# EasyEDA schematic OpenTCU.json

## Sheets
1 SPI CAN: TITLE: SPI CAN; REV: 1.0; Date: 2024-01-22; Sheet: 1/1; Company: Your Company
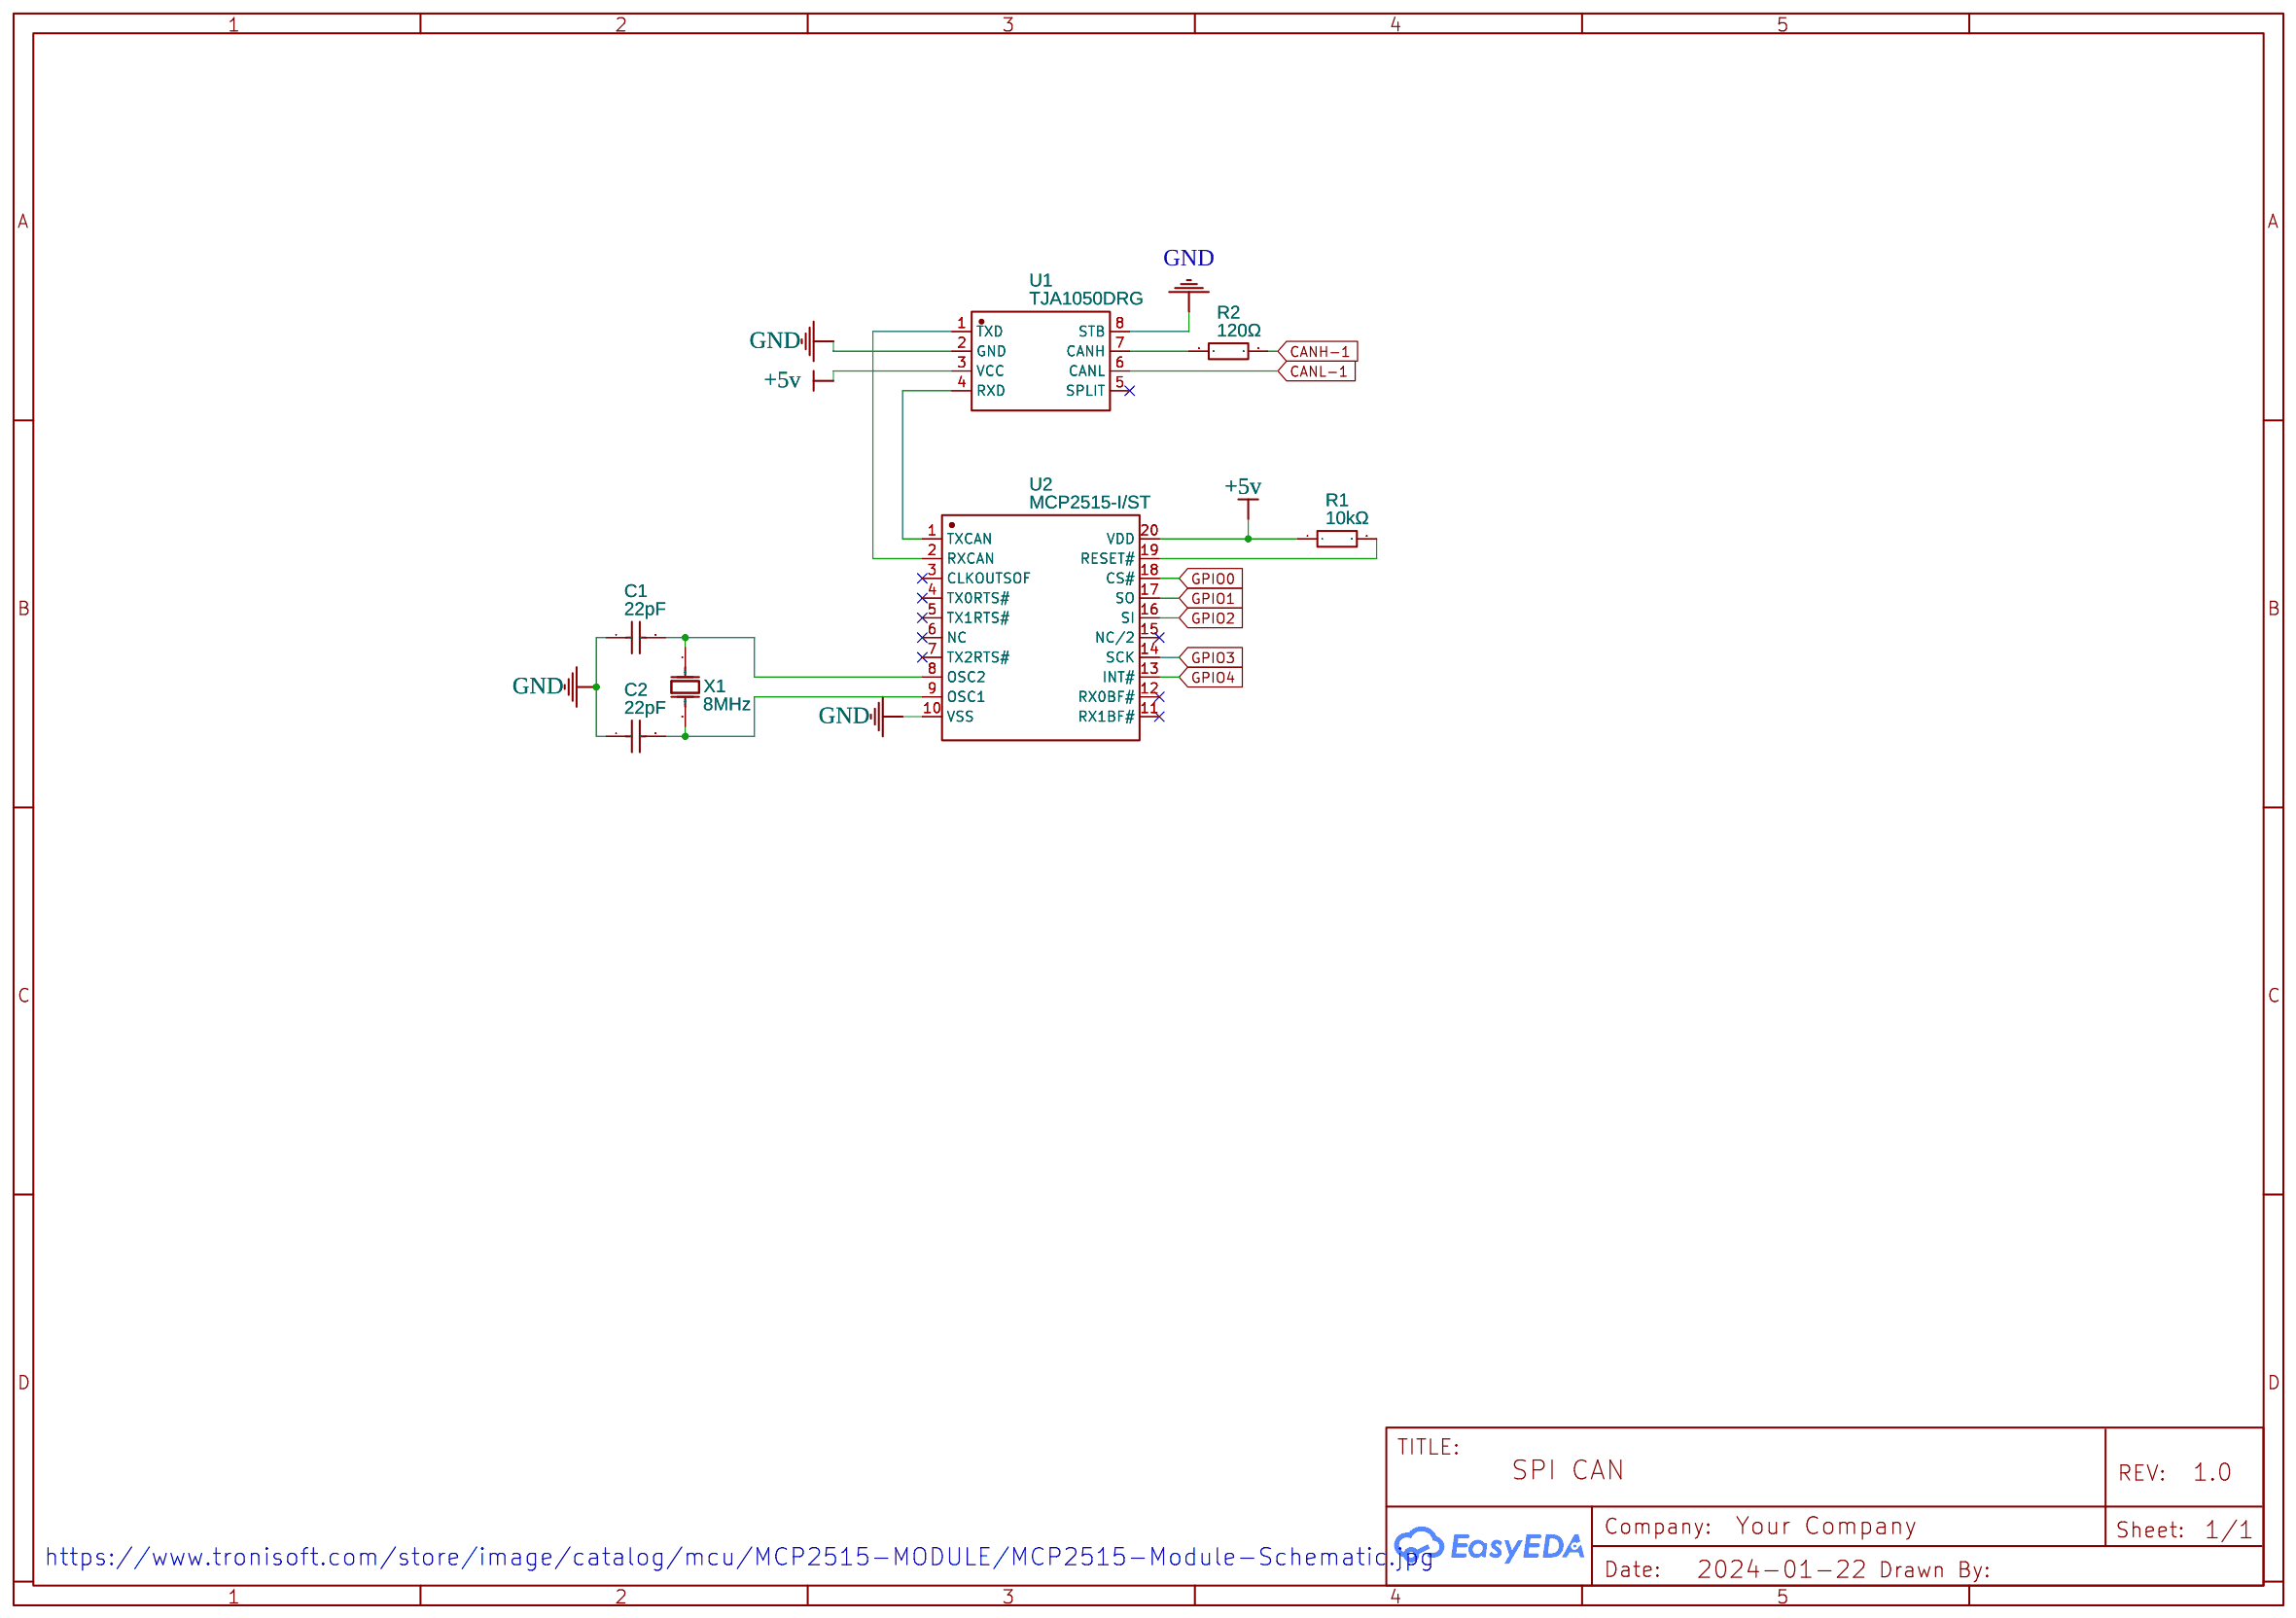
[diagram p0: SPI CAN]
2 TWAI CAN: TITLE: TWAI CAN
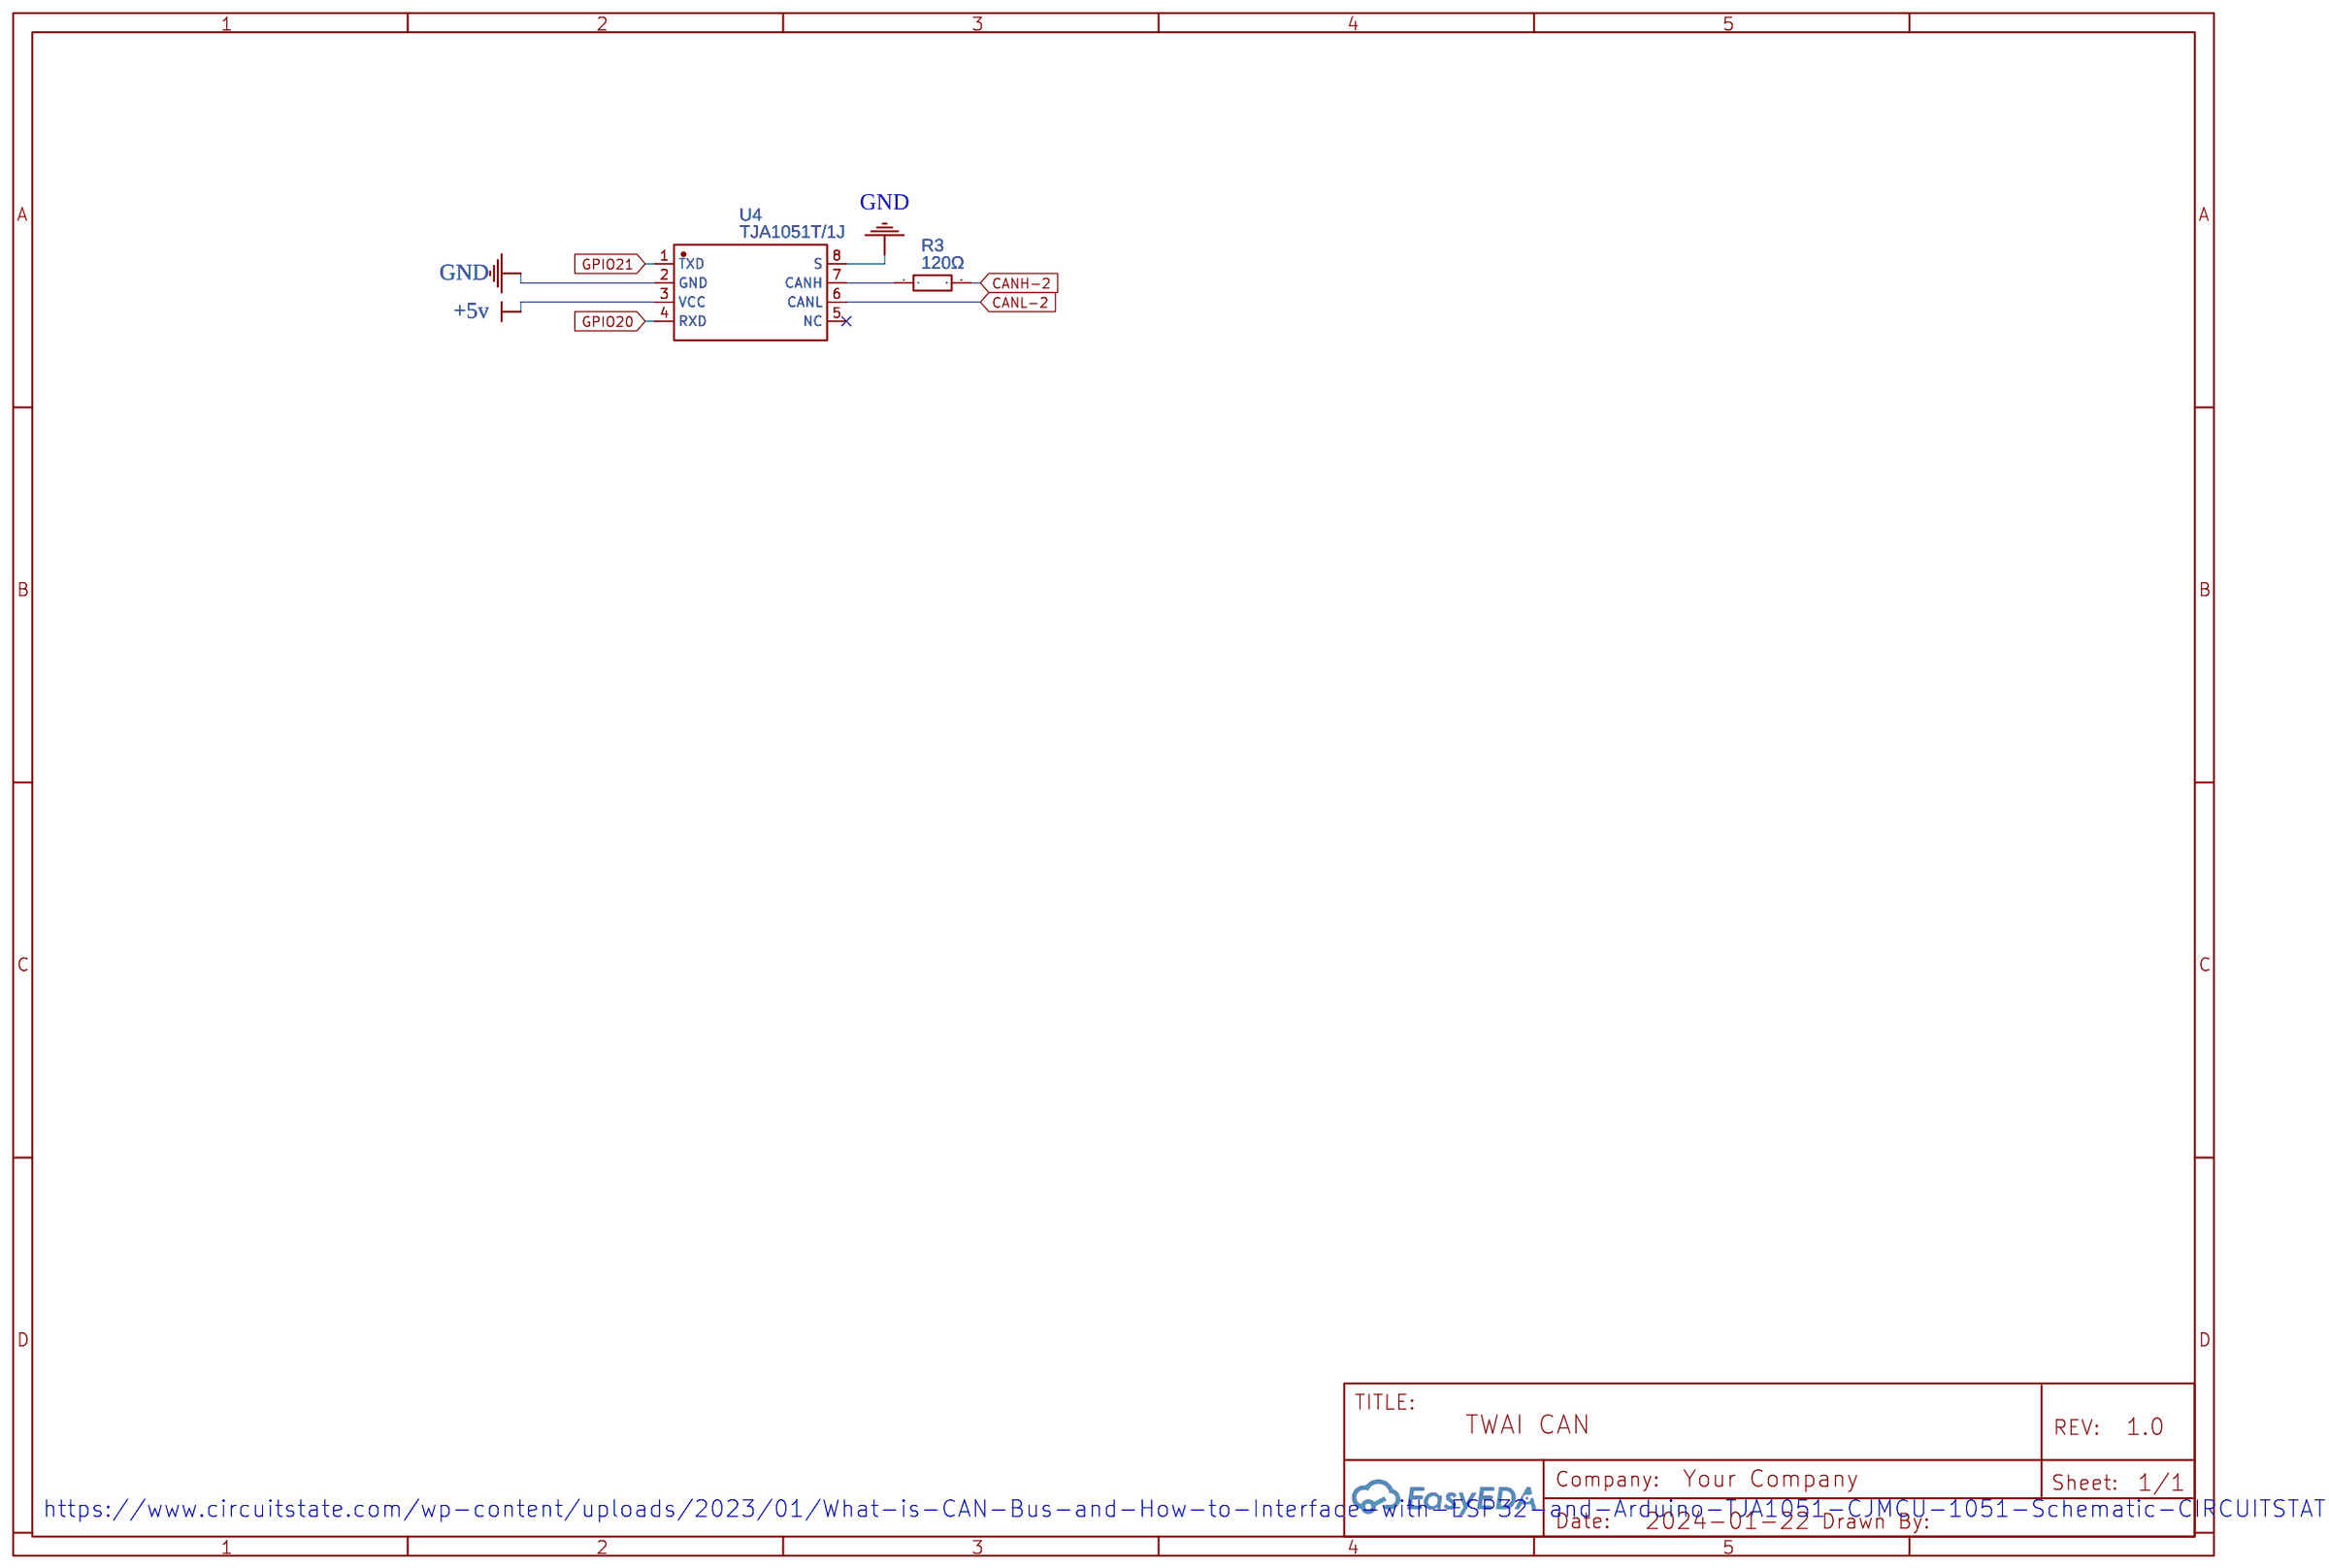
[diagram p1: TWAI CAN]
3 DC-DC Step-down Power Supply: TITLE: DC-DC Step-down Power Supply
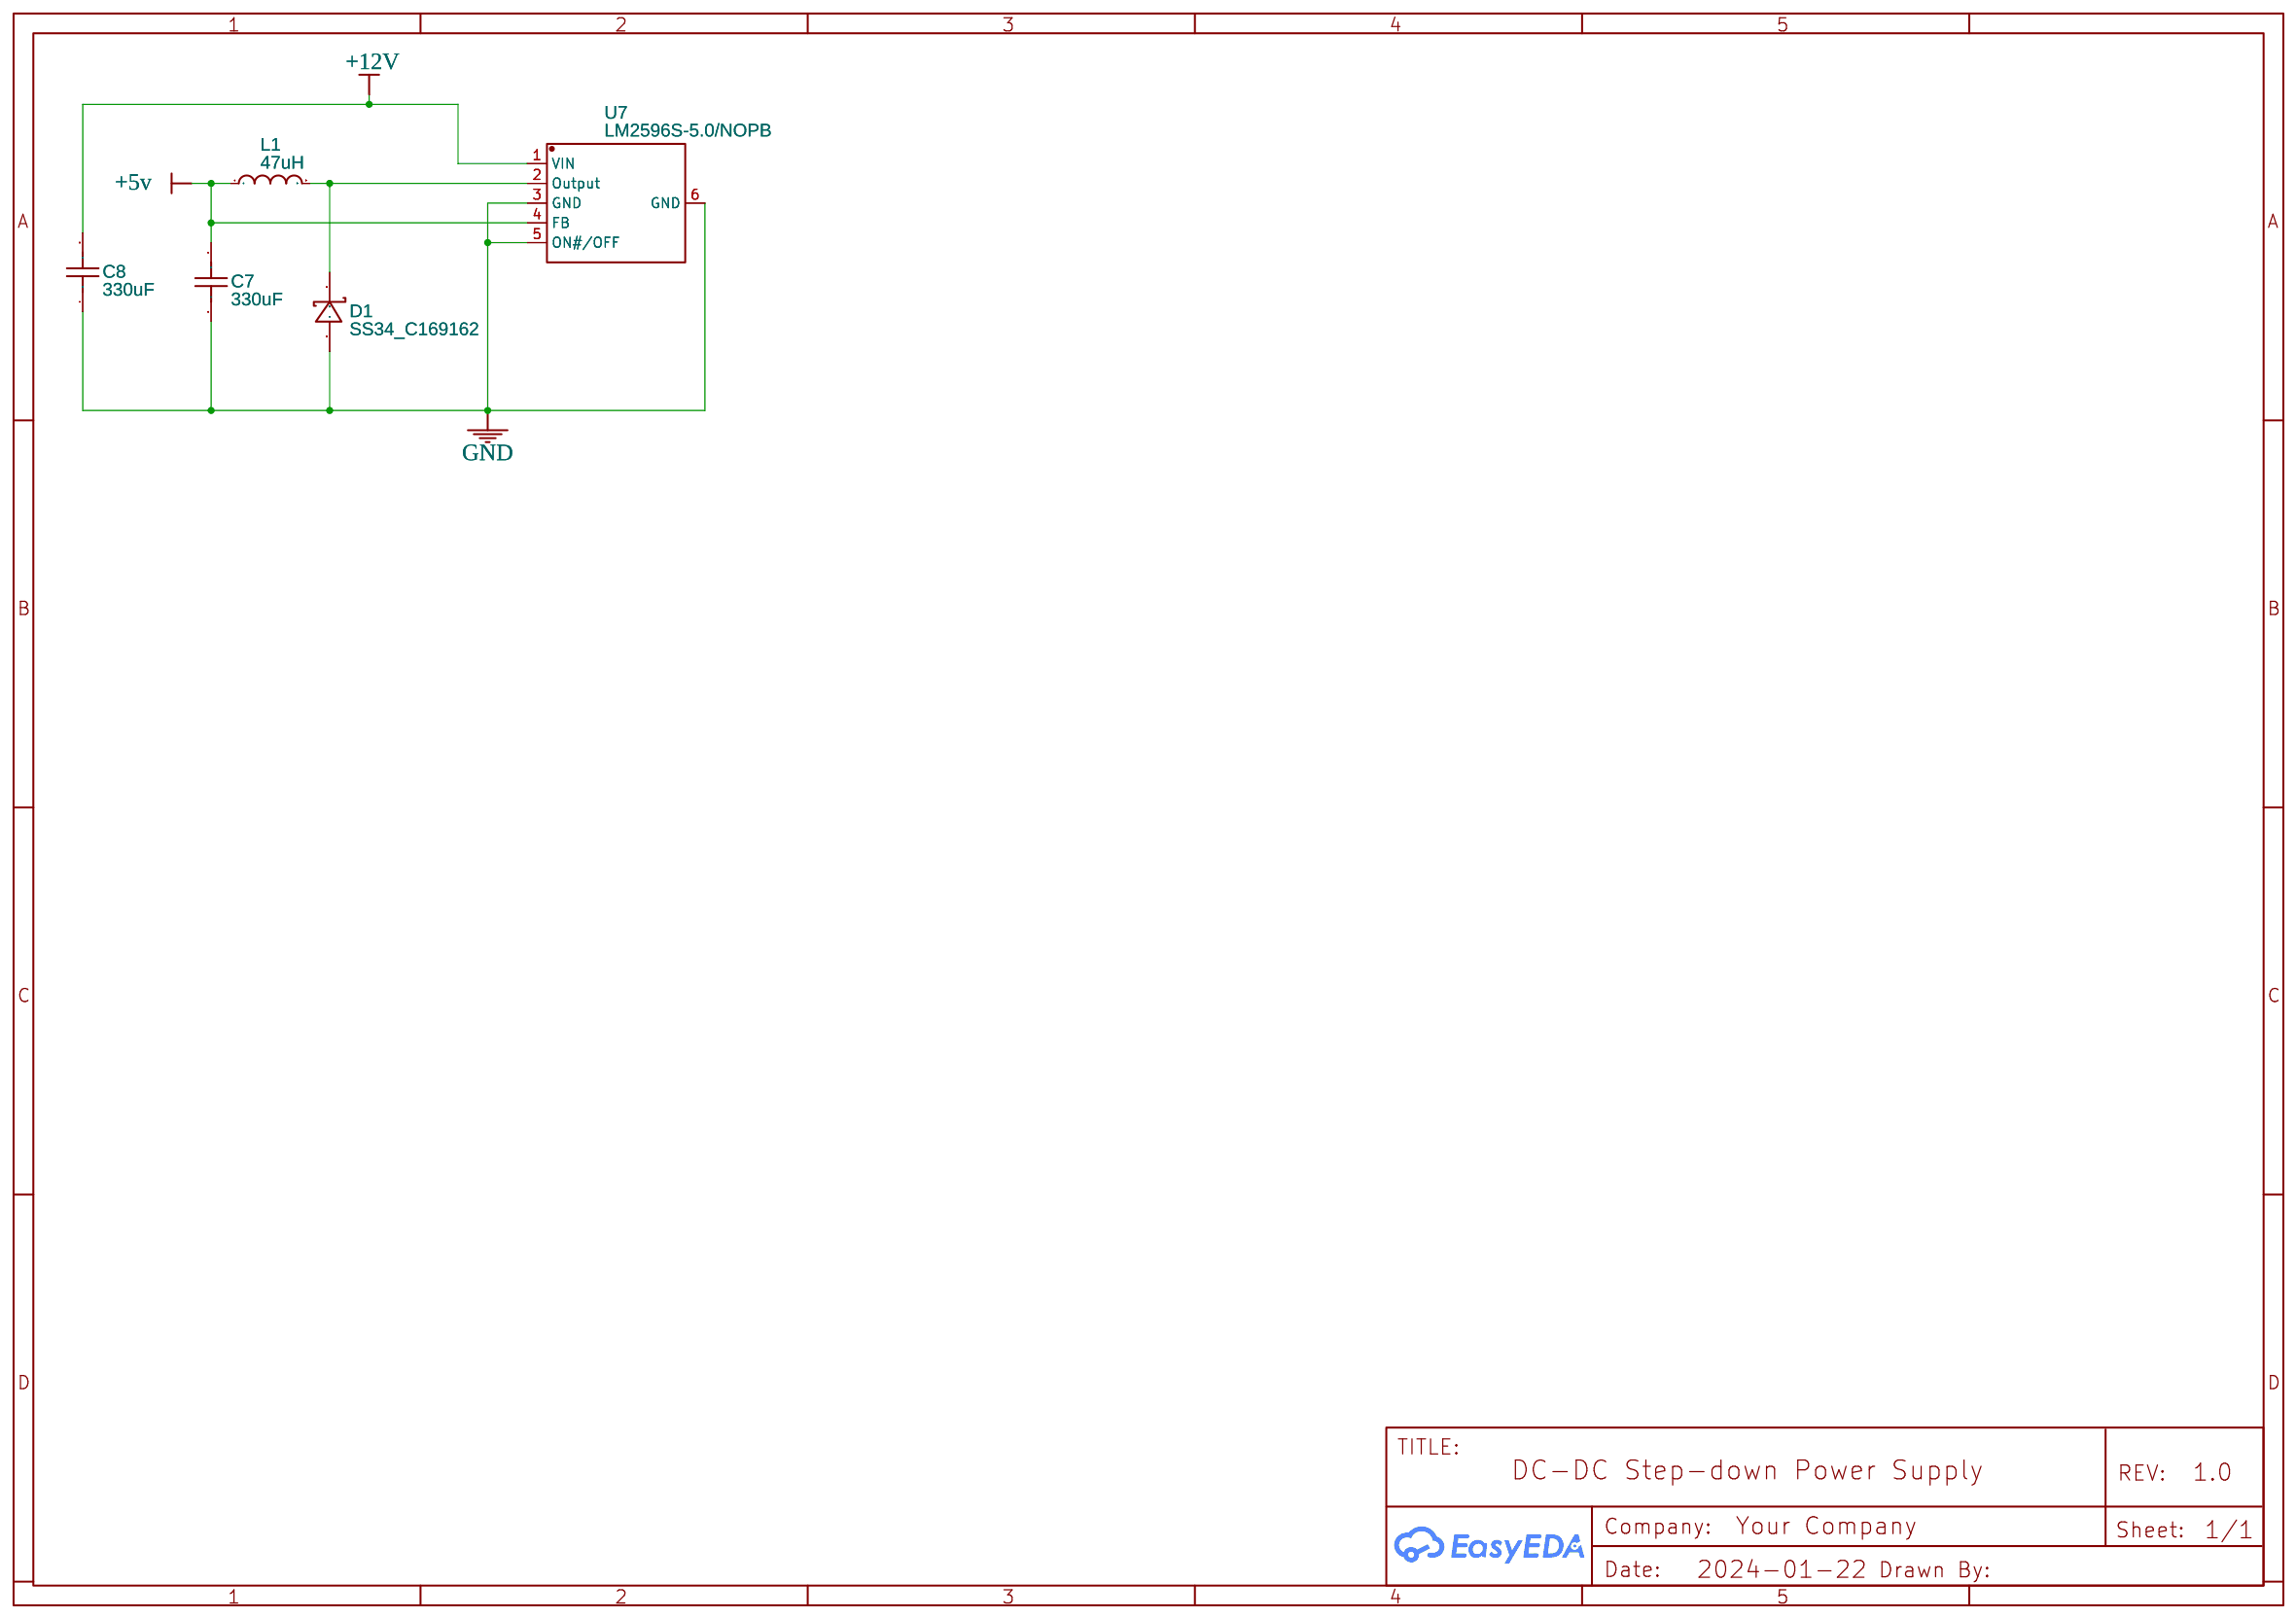
[diagram p2: DC-DC Step-down Power Supply]
4 ESP32-C3: TITLE: ESP32-C3
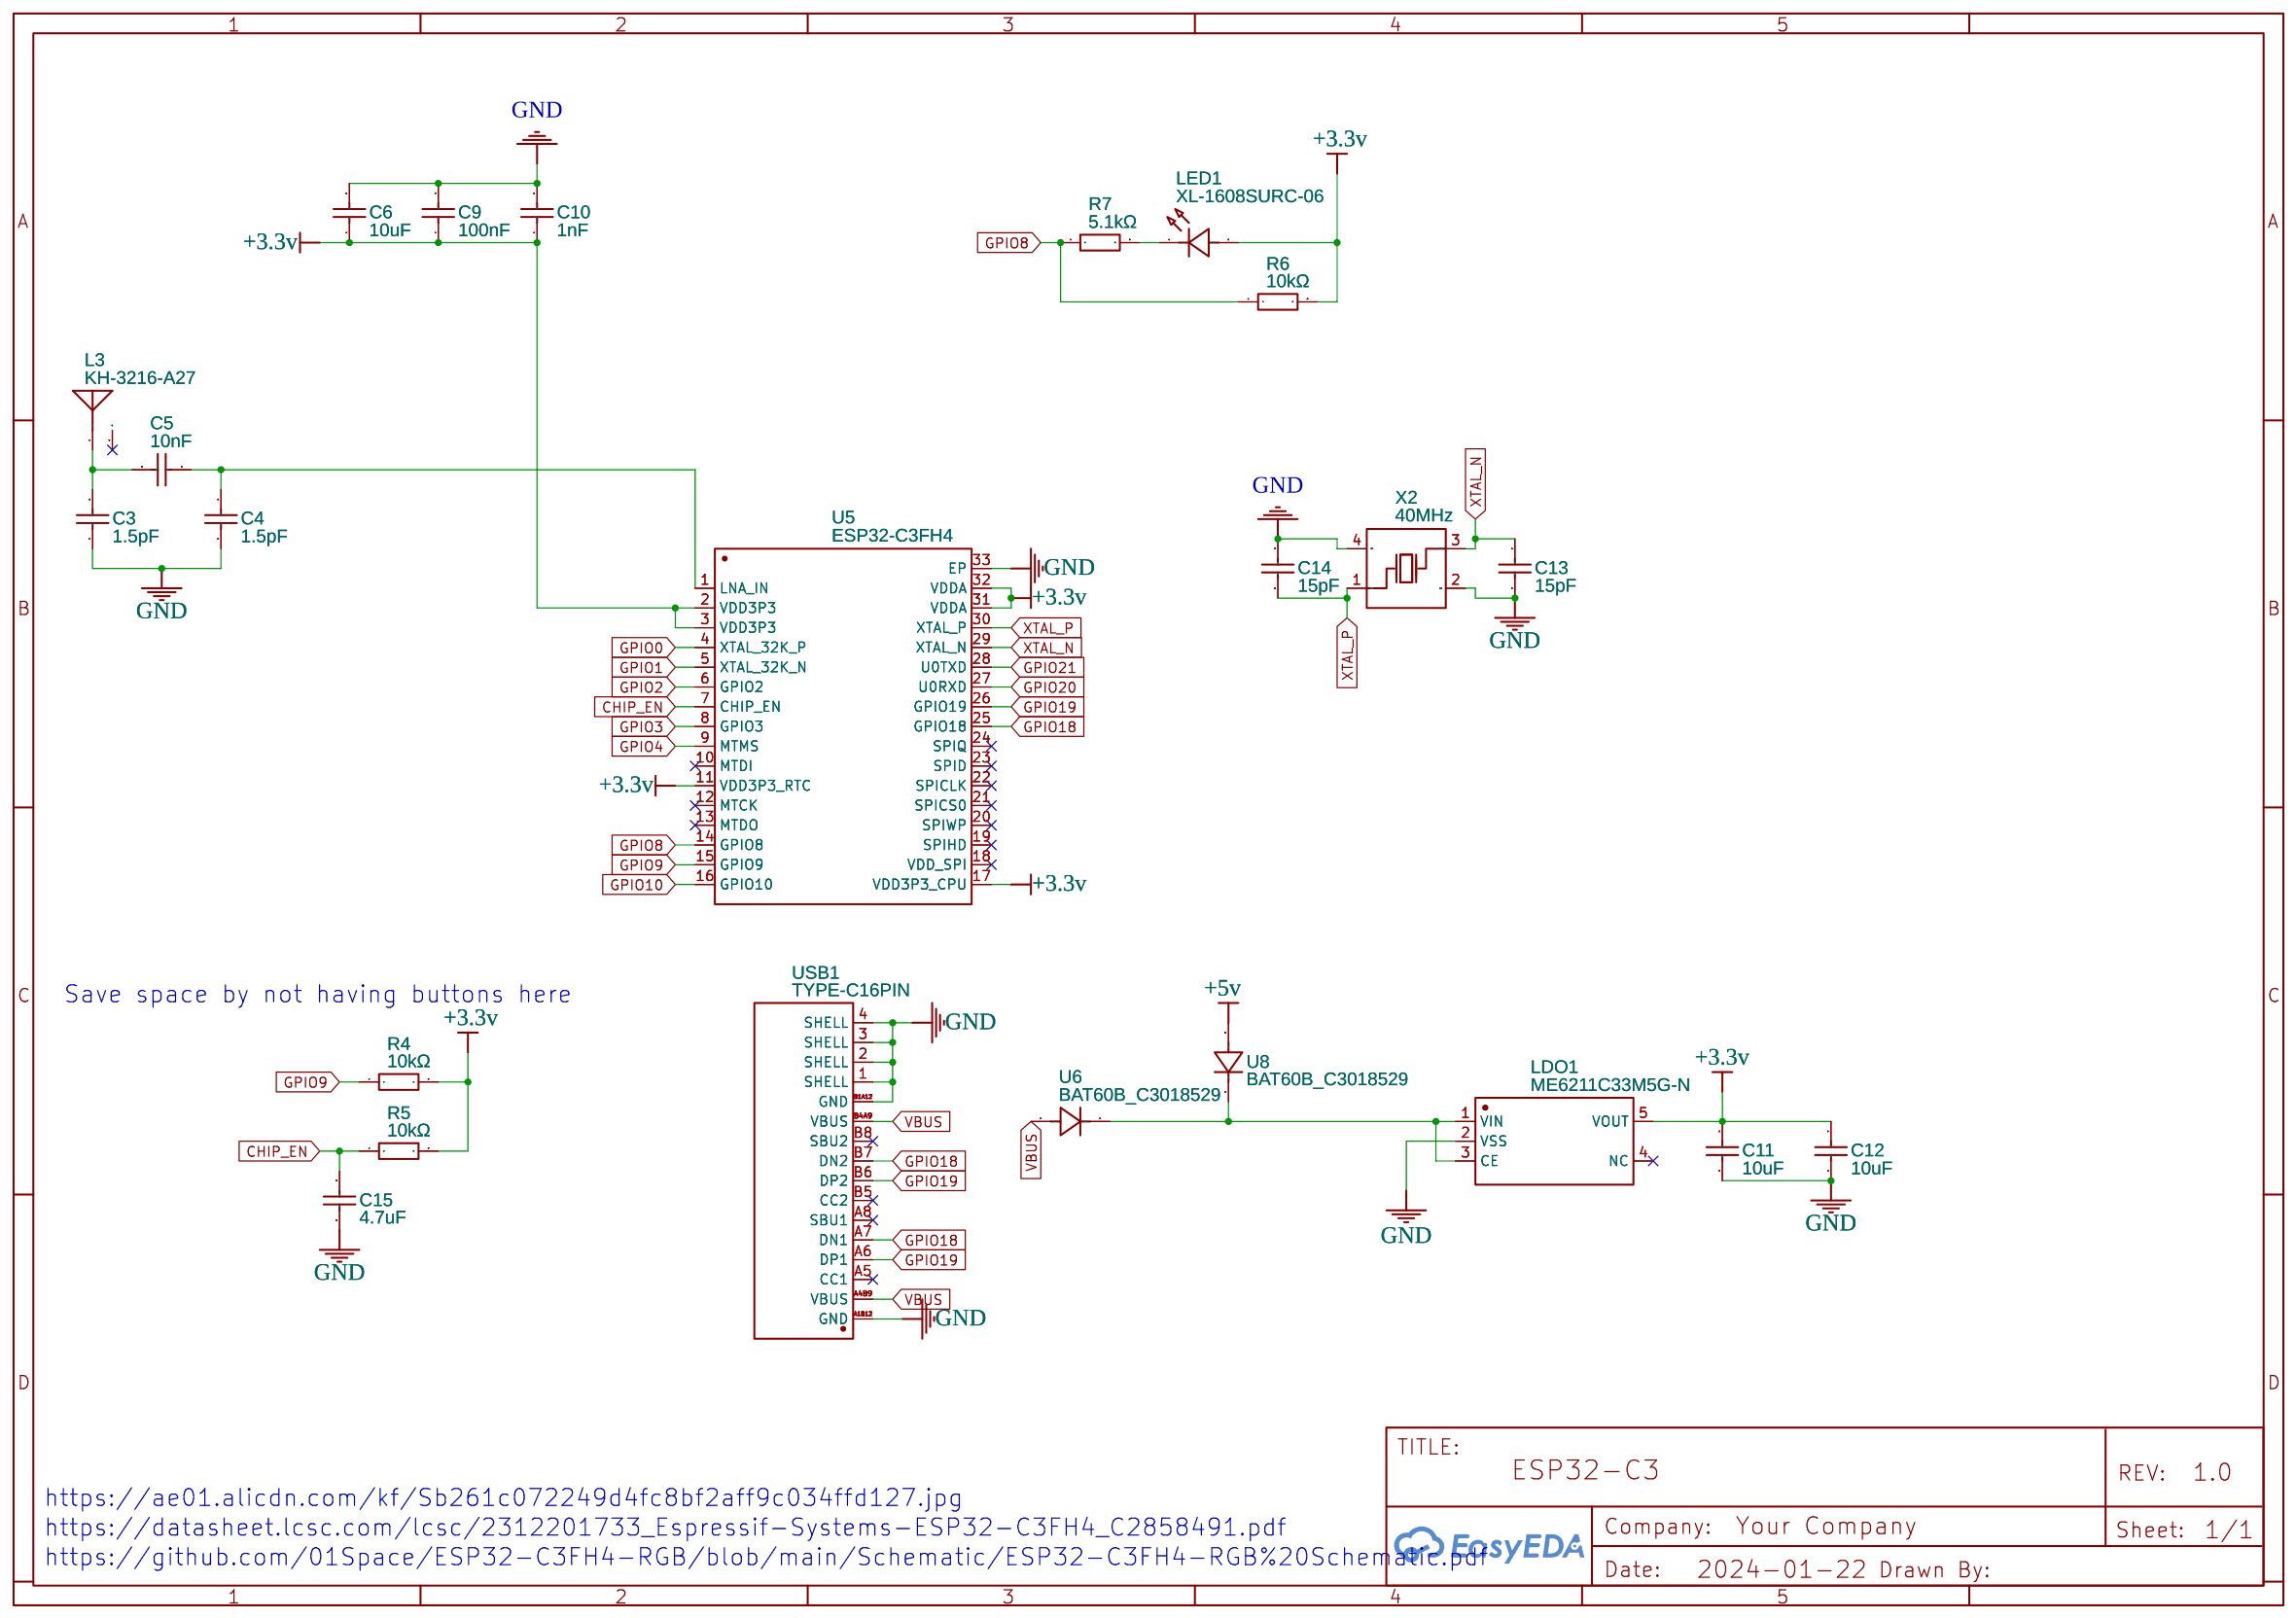
[diagram p3: ESP32-C3]
5 IO: TITLE: IO; Date: 2024-01-23; Drawn By: tristan.read1508
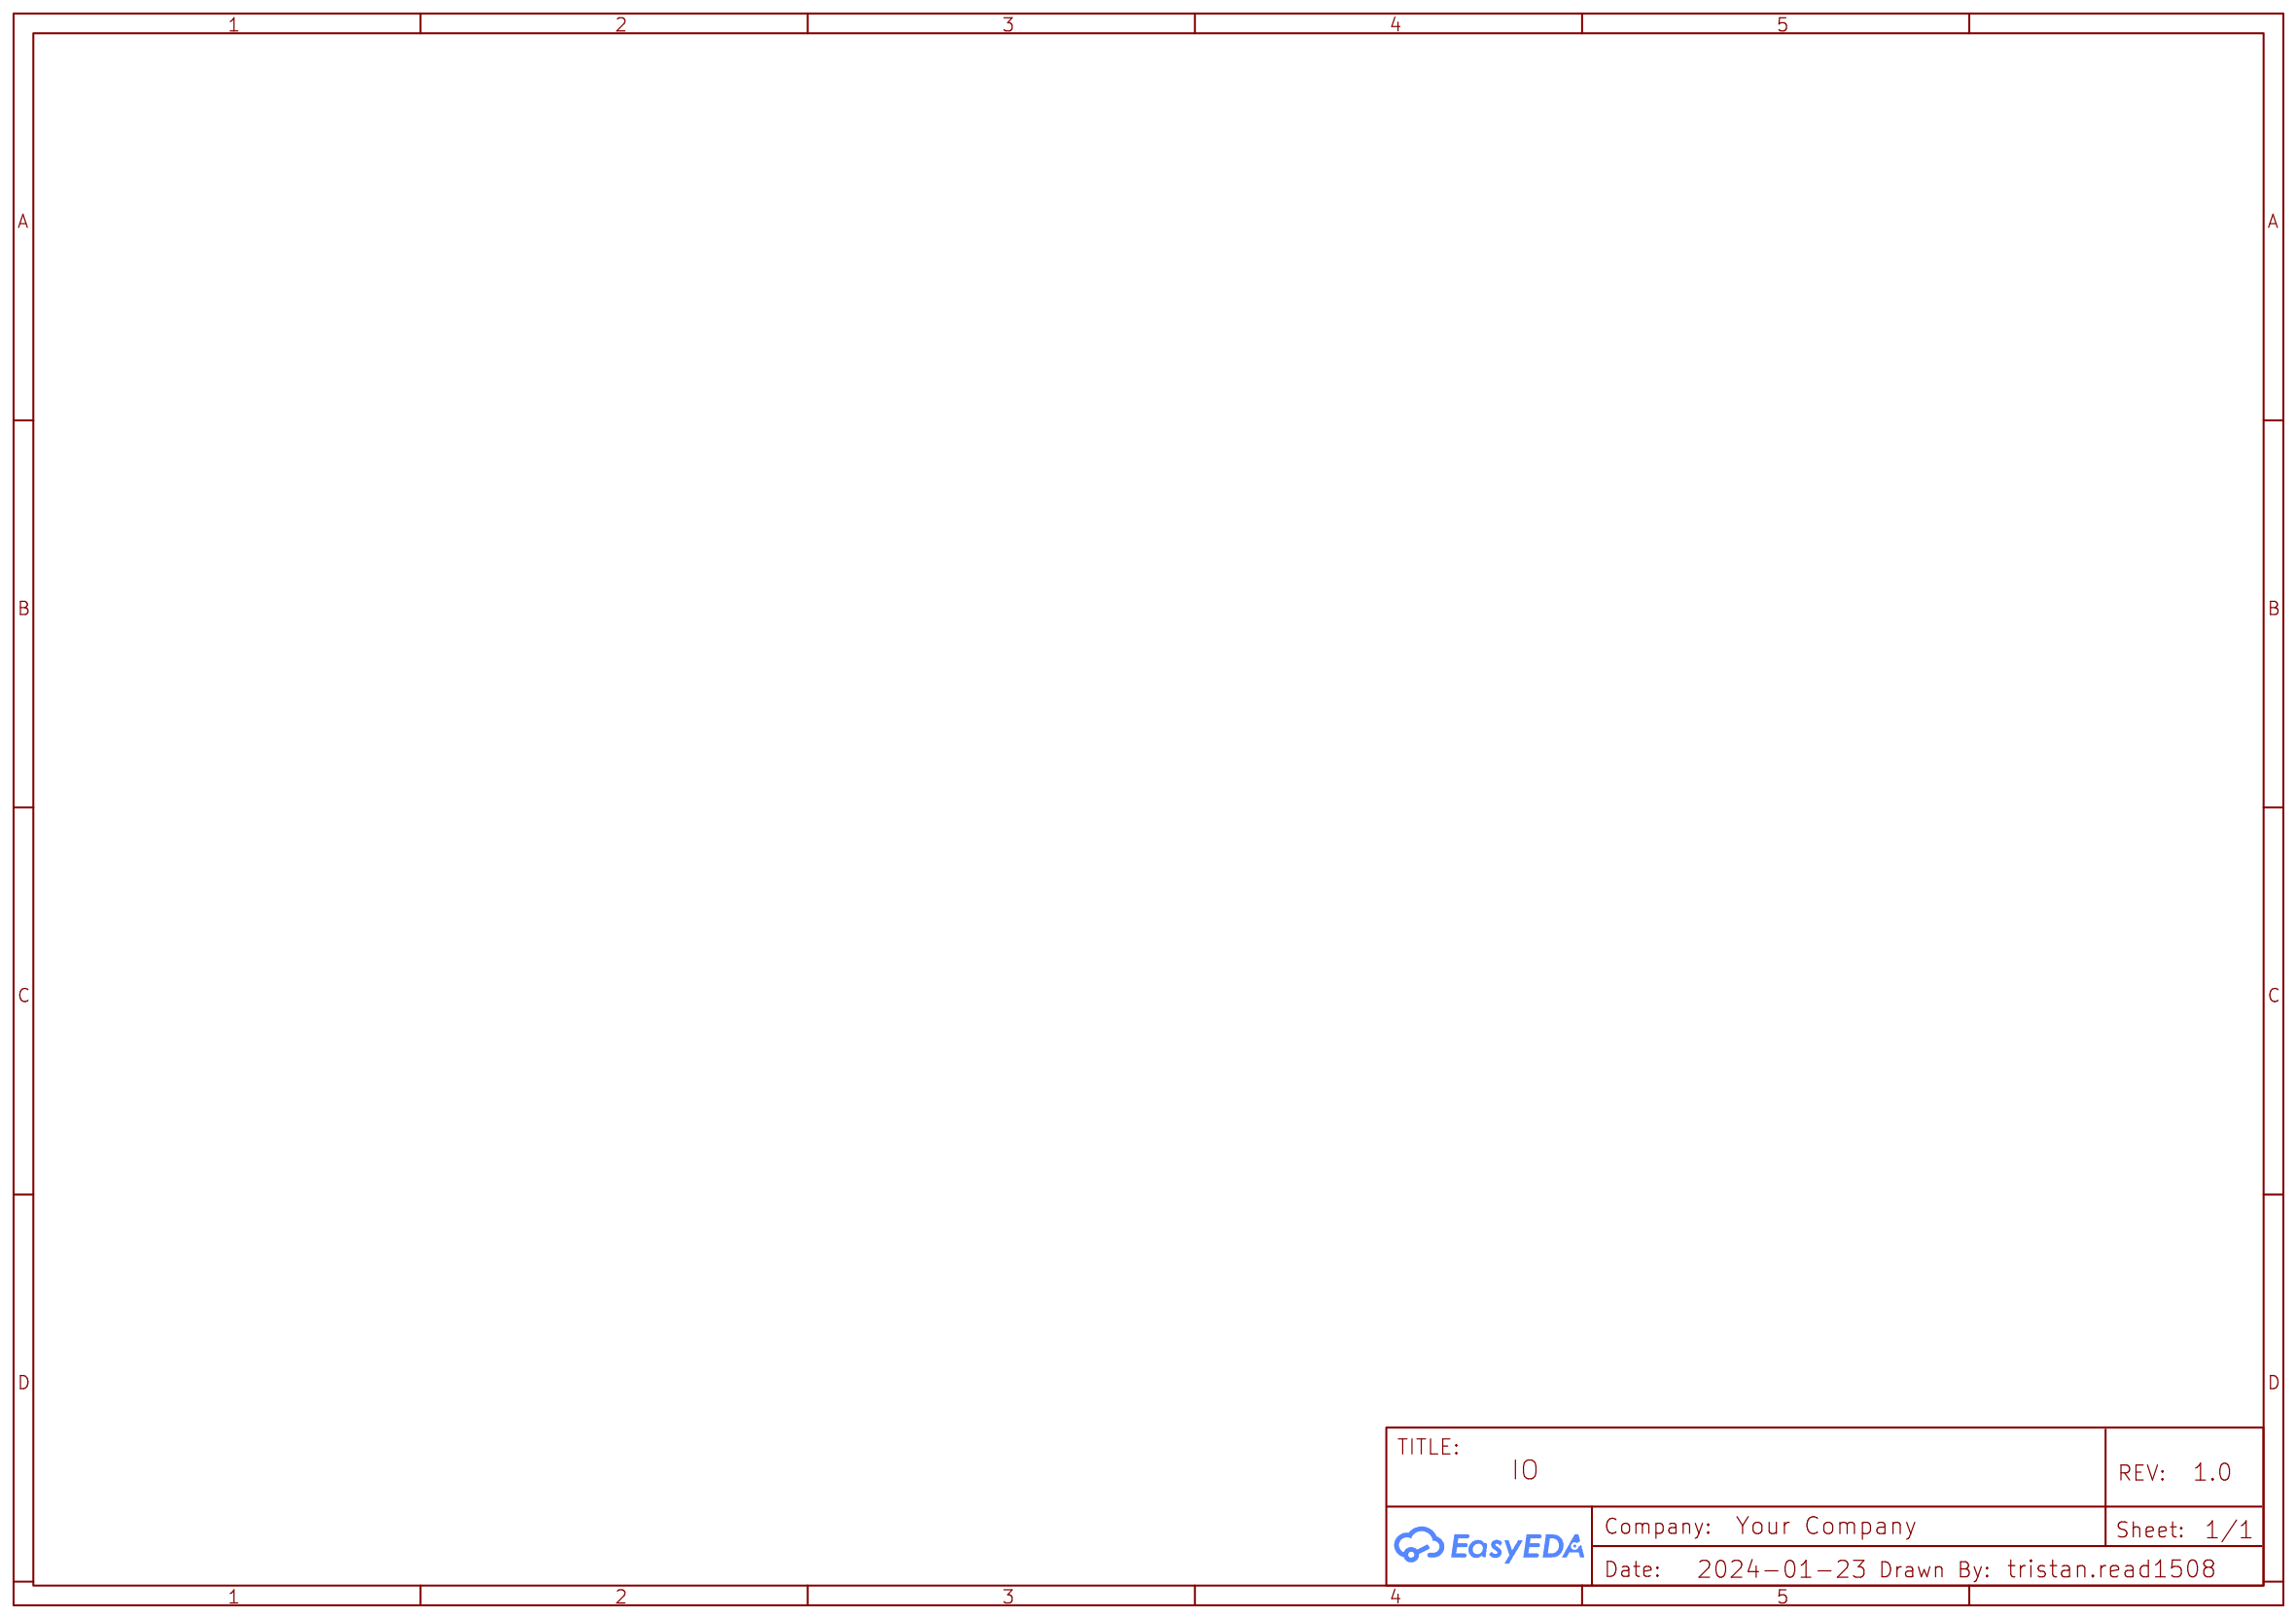
[diagram p4: IO]

## Parts
sheet DC-DC Step-down Power Supply
C7  330uF  [C1210]
C8  330uF  [C1210]
D1  SS34_C169162  [SMC_L6.9-W5.9-LS7.9-RD]
L1  47uH  [IND-SMD_L7.2-W6.6_GPSR07X0]
U7  LM2596S-5.0/NOPB  [TO-263-5_L10.2-W8.6-P1.70-LS14.4-BR]
sheet ESP32-C3
C3  1.5pF  [C0402]
C4  1.5pF  [C0402]
C5  10nF  [C0402]
C6  10uF  [C0402]
C9  100nF  [C0603]
C10  1nF  [C0402]
C11  10uF  [C0402]
C12  10uF  [C0402]
C13  15pF  [C0402]
C14  15pF  [C0402]
C15  4.7uF  [C0603]
L3  KH-3216-A27  [ANT-SMD_L3.2-W1.6]
LDO1  ME6211C33M5G-N  [SOT-23-5_L3.0-W1.7-P0.95-LS2.8-BL]
LED1  XL-1608SURC-06  [LED0603-RD_RED]
R4  10kΩ  [R0603]
R5  10kΩ  [R0603]
R6  10kΩ  [R0603]
R7  5.1kΩ  [R0603]
U5  ESP32-C3FH4  [QFN-32_L5.0-W5.0-P0.50-TL-EP3.7]
U6  BAT60B_C3018529  [SOD-323_L1.7-W1.3-LS2.6-RD-1]
U8  BAT60B_C3018529  [SOD-323_L1.7-W1.3-LS2.6-RD-1]
USB1  TYPE-C16PIN  [USB-C-SMD_TYPE-C16PIN]
X2  40MHz  [OSC-SMD_4P-L3.2-W2.5-BL_SIT8008BI]
sheet SPI CAN
C1  22pF  [C0402]
C2  22pF  [C0402]
R1  10kΩ  [R0603]
R2  120Ω  [R0603]
U1  TJA1050DRG  [SOP-8_L4.9-W3.9-P1.27-LS6.0-BL]
U2  MCP2515-I/ST  [TSSOP-20_L6.5-W4.4-P0.65-LS6.4-BL]
X1  8MHz  [CRYSTAL-SMD_L5.0-W3.2]
sheet TWAI CAN
R3  120Ω  [R0603]
U4  TJA1051T/1J  [SOIC-8_L4.9-W3.9-P1.27-LS6.0-BL]

## Library data of the parts
C7 C8 = GRM32ER60G337ME05L: Contributor: LCSC; Supplier: LCSC; Supplier Part: C528969; Manufacturer: muRata(村田); JLCPCB Part Class: Extended Part
D1 = SS34_C169162: Contributor: LCSC; Supplier Part: C169162; Supplier: LCSC; Manufacturer: null; Manufacturer Part: SS34; JLCPCB Part Class: Extended Part
L1 = CYA0650-47UH: Supplier: LCSC; Supplier Part: C5189938; Manufacturer: SHOU HAN(首韩); JLCPCB Part Class: Extended Part; Contributor: lcsc
U7 = LM2596S-5.0/NOPB: Contributor: LCSC; Supplier: LCSC; Supplier Part: C116713; Manufacturer: TI(德州仪器); JLCPCB Part Class: Extended Part
C3 C4 = 0402CG1R5C500NT: Supplier: LCSC; Manufacturer: FH(风华); Supplier Part: C1552; JLCPCB Part Class: Basic Part
C5 = CC0402KRX7R9BB103: Supplier: LCSC; Manufacturer: YAGEO(国巨); Supplier Part: C60133; JLCPCB Part Class: Extended Part
C6 C11 C12 = CL05A106MQ5NUNC: Supplier: LCSC; Manufacturer: SAMSUNG(三星); Supplier Part: C15525; JLCPCB Part Class: Basic Part
C9 = 0603B104K500NT: Supplier: LCSC; Manufacturer: FH(风华); Supplier Part: C30926; JLCPCB Part Class: Extended Part
C10 = CC0402KRX7R9BB102: Contributor: LCSC; Supplier: LCSC; Manufacturer: YAGEO(国巨); Supplier Part: C106205; JLCPCB Part Class: Extended Part
C13 C14 = 0402CG150J500NT: Supplier: LCSC; Manufacturer: FH(风华); Supplier Part: C1548; JLCPCB Part Class: Basic Part
C15 = CL10A475KP8NNNC: Supplier: LCSC; Manufacturer: SAMSUNG(三星); Supplier Part: C1705; JLCPCB Part Class: Extended Part
L3 = KH-3216-A27: Contributor: LCSC; Supplier: LCSC; Supplier Part: C504001; Manufacturer: kinghelm(金航标); JLCPCB Part Class: Extended Part
LDO1 = ME6211C33M5G-N: Supplier: LCSC; Manufacturer: MICRONE(南京微盟); Supplier Part: C82942; JLCPCB Part Class: Extended Part
LED1 = XL-1608SURC-06: Contributor: LCSC; Supplier: LCSC; Supplier Part: C965799; Manufacturer: XINGLIGHT(成兴光); JLCPCB Part Class: Extended Part
R1 R4-R6 = RC0603FR-0710KL: Supplier: LCSC; Manufacturer: YAGEO(国巨); Supplier Part: C98220; JLCPCB Part Class: Extended Part
R7 = 0603WAF5101T5E: Supplier: LCSC; Manufacturer: UNI-ROYAL(厚声); Supplier Part: C23186; JLCPCB Part Class: Basic Part
U5 = ESP32-C3FH4: Contributor: LCSC; Supplier: LCSC; Supplier Part: C2858491; Manufacturer: ESPRESSIF(乐鑫); JLCPCB Part Class: Extended Part
U6 U8 = BAT60B_C3018529: Contributor: lcsc; Supplier: LCSC; Supplier Part: C3018529; Manufacturer: FUXINSEMI(富芯森美); Manufacturer Part: BAT60B; JLCPCB Part Class: Extended Part
USB1 = TYPE-C16PIN: Contributor: LCSC; Supplier: LCSC; Supplier Part: C393939; Manufacturer: SHOU HAN(首韩); JLCPCB Part Class: Extended Part; link: https://lcsc.com/eda_search?q=C393939&%26type=1&ref=editor
X2 = X322540MPB4SI: Supplier: LCSC; Manufacturer: YXC(扬兴晶振); Supplier Part: C9010; JLCPCB Part Class: Extended Part
C1 C2 = 0402CG220J500NT: Supplier: LCSC; Manufacturer: FH(风华); Supplier Part: C1555; JLCPCB Part Class: Basic Part
R2 R3 = 0603WAF1200T5E: Supplier: LCSC; Manufacturer: UNI-ROYAL(厚声); Supplier Part: C22787; JLCPCB Part Class: Basic Part
U1 = TJA1050DRG: Supplier: LCSC; Supplier Part: C19723770; Manufacturer: HGC(深圳汉芯); Contributor: lcsc
U2 = MCP2515-I/ST: Supplier: LCSC; Manufacturer: MICROCHIP(美国微芯); Supplier Part: C15193; JLCPCB Part Class: Extended Part
X1 = X50328MSB2GI: Supplier: LCSC; Manufacturer: YXC(扬兴晶振); Supplier Part: C115962; JLCPCB Part Class: Basic Part
U4 = TJA1051T/1J: Contributor: LCSC; Supplier: LCSC; Manufacturer: NXP(恩智浦); Supplier Part: C92211; JLCPCB Part Class: Extended Part; link: https://lcsc.com/eda_search?q=C92211&%26type=1&ref=editor

## Nets
+3.3v: C6.1 C9.1 C10.1 C11.2 C12.2 LDO1.5(VOUT) LED1.2(A) R4.2 R5.2 R6.2 U5.2(VDD3P3) U5.3(VDD3P3) U5.11(VDD3P3_RTC) U5.17(VDD3P3_CPU) U5.31(VDDA) U5.32(VDDA)
+5v: C7.1 L1.1 R1.1 U1.3(VCC) U2.20(VDD) U4.3(VCC) U7.4(FB) U8.2(A)
+12V: C8.2 U7.1(VIN)
GND: C1.1 C2.1 C3.1 C4.1 C6.2 C7.2 C8.1 C9.2 C10.2 C11.1 C12.1 C13.1 C14.2 C15.1 D1.2(A) LDO1.2(VSS) U1.2(GND) U1.8(STB) U2.10(VSS) U4.2(GND) U4.8(S) U5.33(EP) U7.3(GND) U7.5(ON#/OFF) U7.6(GND) USB1.1(SHELL) USB1.2(SHELL) USB1.3(SHELL) USB1.4(SHELL) USB1.A1B12(GND) USB1.B1A12(GND) X2.2(GND) X2.4(GND)
VBUS: U6.2(A) USB1.A4B9(VBUS) USB1.B4A9(VBUS)
CANH-1: R2.2
CANH-2: R3.2
CANL-1: U1.6(CANL)
CANL-2: U4.6(CANL)
CHIP_EN: C15.2 R5.1 U5.7(CHIP_EN)
GPIO0: U2.18(CS#) U5.4(XTAL_32K_P)
GPIO1: U2.17(SO) U5.5(XTAL_32K_N)
GPIO2: U2.16(SI) U5.6(GPIO2)
GPIO3: U2.14(SCK) U5.8(GPIO3)
GPIO4: U2.13(INT#) U5.9(MTMS)
GPIO8: R6.1 R7.1 U5.14(GPIO8)
GPIO9: R4.1 U5.15(GPIO9)
GPIO10: U5.16(GPIO10)
GPIO18: U5.25(GPIO18) USB1.A7(DN1) USB1.B7(DN2)
GPIO19: U5.26(GPIO19) USB1.A6(DP1) USB1.B6(DP2)
GPIO20: U4.4(RXD) U5.27(U0RXD)
GPIO21: U4.1(TXD) U5.28(U0TXD)
XTAL_N: C13.2 U5.29(XTAL_N) X2.3(OSC2)
XTAL_P: C14.1 U5.30(XTAL_P) X2.1(OSC1)
Net-(C1-2): C1.2 U2.8(OSC2) X1.1(OSC1)
Net-(C2-2): C2.2 U2.9(OSC1) X1.2(OSC2)
Net-(C3-2): C3.2 C5.1 L3.1(ANT)
Net-(C4-2): C4.2 C5.2 U5.1(LNA_IN)
Net-(D1-1): D1.1(C) L1.2 U7.2(Output)
Net-(LDO1-1): LDO1.1(VIN) LDO1.3(CE) U6.1(K) U8.1(K)
Net-(LED1-1): LED1.1(K) R7.2
Net-(R1-2): R1.2 U2.19(RESET#)
Net-(R2-1): R2.1 U1.7(CANH)
Net-(R3-1): R3.1 U4.7(CANH)
Net-(U1-1): U1.1(TXD) U2.2(RXCAN)
Net-(U1-4): U1.4(RXD) U2.1(TXCAN)

Not connected (* = marked no-connect by the designer): L3 2*; LDO1 4(NC)*; U1 5(SPLIT)*; U2 3(CLKOUTSOF)* 4(TX0RTS#)* 5(TX1RTS#)* 6(NC)* 7(TX2RTS#)* 11(RX1BF#)* 12(RX0BF#)* 15(NC/2)*; U4 5(NC)*; U5 10(MTDI)* 12(MTCK)* 13(MTDO)* 18(VDD_SPI)* 19(SPIHD)* 20(SPIWP)* 21(SPICS0)* 22(SPICLK)* 23(SPID)* 24(SPIQ)*; USB1 A5(CC1)* A8(SBU1)* B5(CC2)* B8(SBU2)*

## Notes on the sheets
sheet 1
- https://www.tronisoft.com/store/image/catalog/mcu/MCP2515-MODULE/MCP2515-Module-Schematic.jpg
sheet 2
- https://www.circuitstate.com/wp-content/uploads/2023/01/What-is-CAN-Bus-and-How-to-Interface-with-ESP32-and-Arduino-TJA1051-CJMCU-1051-Schematic-CIRCUITSTATE-Electronics-01-768x661.png
sheet 4
- Save space by not having buttons here
- https://ae01.alicdn.com/kf/Sb261c072249d4fc8bf2aff9c034ffd127.jpg
- https://datasheet.lcsc.com/lcsc/2312201733_Espressif-Systems-ESP32-C3FH4_C2858491.pdf
- https://github.com/01Space/ESP32-C3FH4-RGB/blob/main/Schematic/ESP32-C3FH4-RGB%20Schematic.pdf
